# EAGLE design MICRO_MODULAR_batt2 (EAGLE 7.5.0)
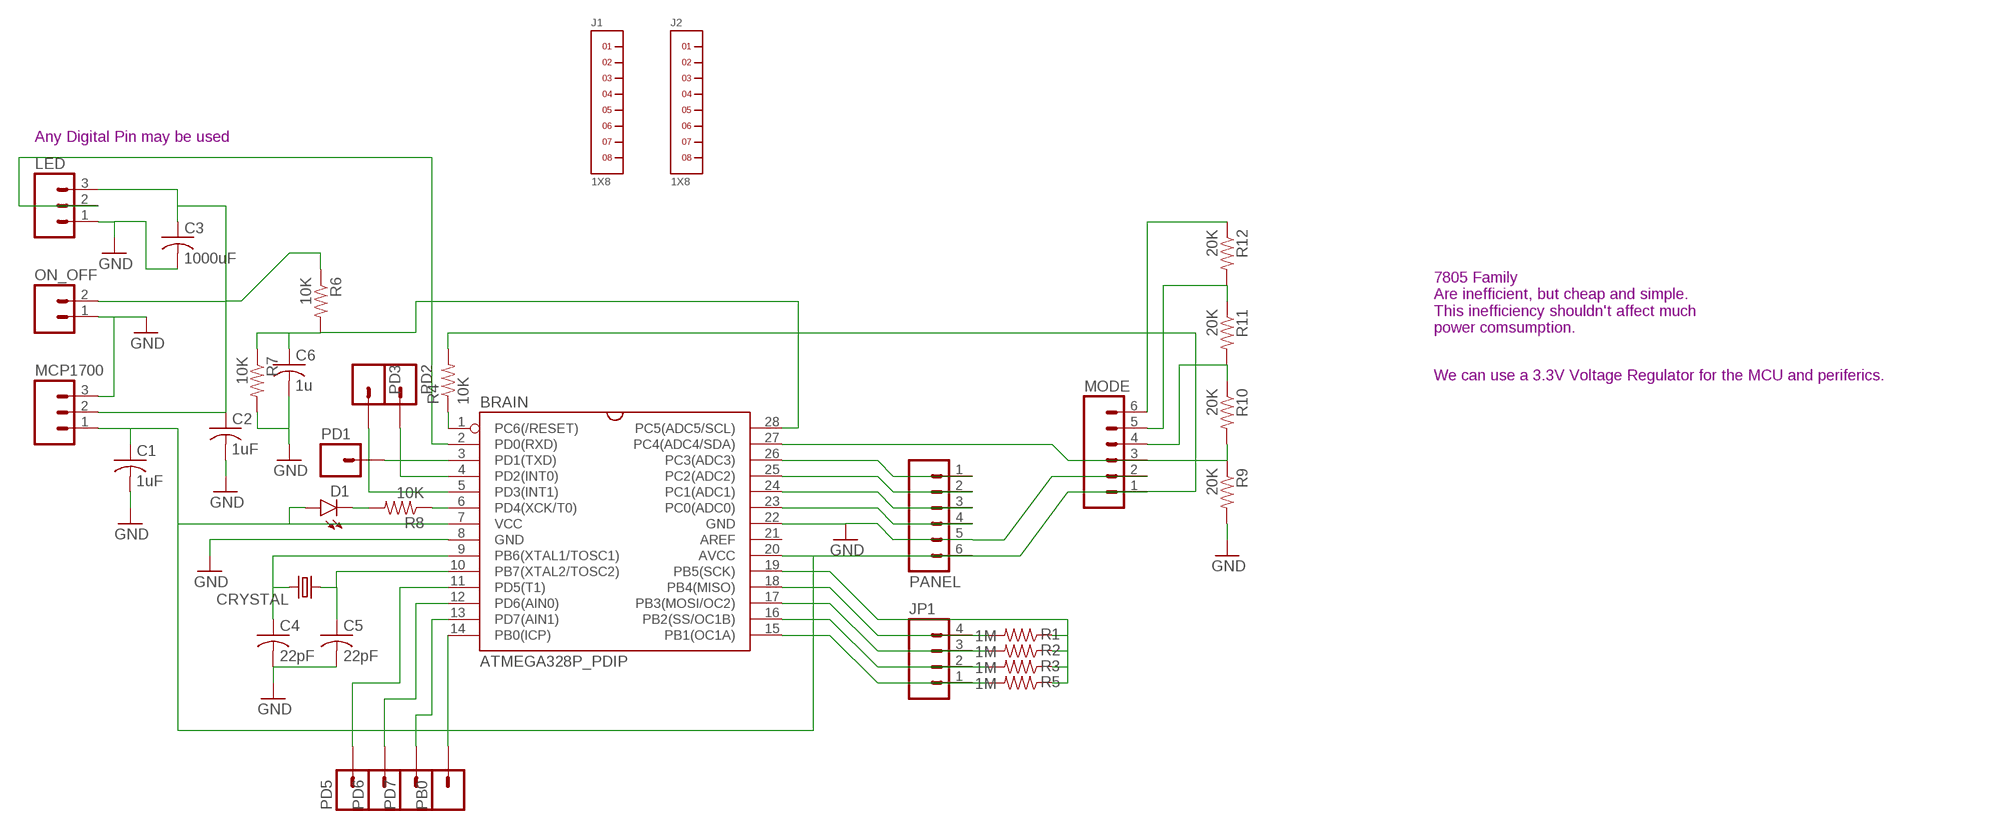
[diagram p0: schematic, sheet 1]

## Parts
BRAIN  ATMEGA328P_PDIP  [DIL-28-3]
C1  1uF  C-US050-025X075  [C050-025X075]
C2  1uF  C-US050-025X075  [C050-025X075]
C3  1000uF  C-US050-075X075  [C050-075X075]
C4  22pF  C-US025-024X044  [C025-024X044]
C5  22pF  C-US025-024X044  [C025-024X044]
C6  1u  C-US050-025X075  [C050-025X075]
CRYSTAL  CRYSTALHC49US  [HC49US]
D1  LED3MM  [LED3MM]
J1  1X8  [1X8]
J2  1X8  [1X8]
JP1  M04PTH  [1X04]
LED  M03PTH  [1X03]
MCP1700  M03PTH  [1X03]
MODE  M06SILK_FEMALE_PTH  [1X06]
ON_OFF  M02PTH  [1X02]
PANEL  M06NO_SILK_FEMALE_PTH  [1X06_NO_SILK]
PB0  M01PTH  [1X01]
PD1  M01PTH  [1X01]
PD2  M01PTH  [1X01]
PD3  M01PTH  [1X01]
PD5  M01PTH  [1X01]
PD6  M01PTH  [1X01]
PD7  M01PTH  [1X01]
R1  1M  RESISTORAXIAL-0.3  [AXIAL-0.3]
R2  1M  RESISTORAXIAL-0.3  [AXIAL-0.3]
R3  1M  RESISTORAXIAL-0.3  [AXIAL-0.3]
R4  10K  RESISTORAXIAL-0.3  [AXIAL-0.3]
R5  1M  RESISTORAXIAL-0.3  [AXIAL-0.3]
R6  10K  RESISTORAXIAL-0.3  [AXIAL-0.3]
R7  10K  RESISTORAXIAL-0.3  [AXIAL-0.3]
R8  10K  RESISTORAXIAL-0.3  [AXIAL-0.3]
R9  20K  RESISTORAXIAL-0.3  [AXIAL-0.3]
R10  20K  RESISTORAXIAL-0.3  [AXIAL-0.3]
R11  20K  RESISTORAXIAL-0.3  [AXIAL-0.3]
R12  20K  RESISTORAXIAL-0.3  [AXIAL-0.3]

## Nets
BLUE_BRAIN: BRAIN.25(PC2(ADC2)) PANEL.2
GND: BRAIN.8(GND) BRAIN.22(GND) C1.2 C2.2 C3.2 C4.2 C5.2 C6.2 LED.1 MCP1700.3 MODE.2 ON_OFF.1 PANEL.5 R7.P$2 R9.P$2
GREEN_BRAIN: BRAIN.24(PC1(ADC1)) PANEL.3
LEDS_BRAIN: BRAIN.2(PD0(RXD)) LED.2
N$1: BRAIN.28(PC5(ADC5/SCL)) C6.1 R6.P$2 R7.P$1
N$2: BRAIN.15(PB1(OC1A)) JP1.1 R5.P$2
N$3: BRAIN.16(PB2(SS/OC1B)) JP1.2 R3.P$2
N$4: BRAIN.17(PB3(MOSI/OC2)) JP1.3 R2.P$2
N$5: BRAIN.18(PB4(MISO)) JP1.4 R1.P$2
N$6: BRAIN.19(PB5(SCK)) R1.P$1 R2.P$1 R3.P$1 R5.P$1
N$7: BRAIN.9(PB6(XTAL1/TOSC1)) C4.1 CRYSTAL.2
N$8: BRAIN.10(PB7(XTAL2/TOSC2)) C5.1 CRYSTAL.1
N$9: BRAIN.5(PD3(INT1)) PD3.1
N$10: D1.K(C) R8.P$2
N$11: BRAIN.6(PD4(XCK/T0)) R8.P$1
N$12: BRAIN.4(PD2(INT0)) PD2.1
N$13: BRAIN.27(PC4(ADC4/SDA)) MODE.3 R9.P$1 R10.P$2
N$14: BRAIN.12(PD6(AIN0)) PD6.1
N$15: BRAIN.13(PD7(AIN1)) PD7.1
N$16: BRAIN.14(PB0(ICP)) PB0.1
N$17: BRAIN.3(PD1(TXD)) PD1.1
N$18: BRAIN.11(PD5(T1)) PD5.1
N$19: MODE.6 R12.P$1
N$20: MODE.5 R11.P$1 R12.P$2
N$21: MODE.4 R10.P$1 R11.P$2
RED_BRAIN: BRAIN.26(PC3(ADC3)) PANEL.1
RST: BRAIN.1(PC6(/RESET)) R4.P$1
SPEED_BRAIN: BRAIN.23(PC0(ADC0)) PANEL.4
SWITCH_BRAIN: C2.1 C3.1 LED.3 MCP1700.2 ON_OFF.2 R6.P$1
V_5V: BRAIN.7(VCC) BRAIN.20(AVCC) C1.1 D1.A MCP1700.1 MODE.1 PANEL.6 R4.P$2
Unconnected: BRAIN.21(AREF) J1.1 J1.2 J1.3 J1.4 J1.5 J1.6 J1.7 J1.8 J2.1 J2.2 J2.3 J2.4 J2.5 J2.6 J2.7 J2.8

## Notes on the sheet
- Any Digital Pin may be used
- 7805 Family
  Are inefficient, but cheap and simple.
  This inefficiency shouldn't affect much
  power comsumption.
- We can use a 3.3V Voltage Regulator for the MCU and periferics.

## Library data of the parts
BRAIN = RodrigoMarques_Parts:ATMEGA328P_PDIP: uC used in the Arduino 32kb flash, 1k EEPROM, 2k SRAM This is the through-hole version of this chip.
C1-C6 = adafruit:C-US: CAPACITOR, American symbol
CRYSTAL = SparkFun-FreqCtrl:CRYSTAL: Various standard crystals. Proven footprints.
D1 = SparkFun-LED:LED: LEDs Standard schematic elements and footprints for 5mm, 3mm, 1206, and 0603 sized LEDs. 5mm - Spark Fun Electronics SKU : COM-00529 (and others)
J1 J2 = RodrigoMarques_Parts:1X8: 1x8 Header Specificications 2mm pitch. 1 row 8 pins
JP1 = SparkFun-Connectors:M04: Header 4 Standard 4-pin 0.1" header. Use with straight break away headers (SKU : PRT-00116), right angle break away headers (PRT-00553), swiss pins (PRT-00743), machine pins (PRT-00117), and female headers (PRT-00115). Molex polarized connector foot print use with SKU : PRT-08231 with associated crimp pins and housings. 1MM SMD Version SKU: PRT-10208
LED MCP1700 = SparkFun-Connectors:M03: Header 3 Standard 3-pin 0.1" header. Use with straight break away headers (SKU : PRT-00116), right angle break away headers (PRT-00553), swiss pins (PRT-00743), machine pins (PRT-00117), and female headers (PRT-00115). Molex polarized connector foot print use with SKU : PRT-08232 with associated crimp pins and housings.
MODE PANEL = SparkFun-Connectors:M06: Header 6 Standard 6-pin 0.1" header. Use with straight break away headers (SKU : PRT-00116), right angle break away headers (PRT-00553), swiss pins (PRT-00743), machine pins (PRT-00117), and female headers (PRT-00115). Molex polarized connector foot print use with SKU : PRT-08094 with associated crimp pins and housings. NOTES ON THE VARIANTS LOCK and LOCK_LONGPADS... This footprint was designed to help hold the alignment of a through-hole component (i.e. 6-pin header) while soldering it into place. You may notice that each hole has been shifted either up or down by 0.005 of an inch from it's more standard position (which is a perfectly straight line). This slight alteration caused the pins (the squares in the middle) to touch the edges of the holes. Because they are alternating, it causes a "brace" to hold the component in place. 0.005 has proven to be the perfect amount of "off-center" position when using our standard breakaway headers. Although looks a little odd when you look at the bare footprint, once you have a header in there, the alteration is very hard to notice. Also,if you push a header all the way into place, it is covered up entirely on the bottom side. This idea of altering the position of holes to aid alignment will be further integrated into the Sparkfun Library for other footprints. It can help hold any component with 3 or more connection pins.; PROD_ID: CONN-08437
ON_OFF = SparkFun-Connectors:M02: Standard 2-pin 0.1" header. Use with - straight break away headers ( PRT-00116) - right angle break away headers (PRT-00553) - swiss pins (PRT-00743) - machine pins (PRT-00117) - female headers (PRT-00115) Molex polarized connector foot print use with: PRT-08233 with associated crimp pins and housings. 2.54_SCREWTERM for use with PRT-10571. 3.5mm Screw Terminal footprints for PRT-08084 5mm Screw Terminal footprints for use with PRT-08432
PB0 PD1-PD3 PD5-PD7 = SparkFun-Connectors:M01: Header 1 Standard 1-pin 0.1" header. Use with straight break away headers (SKU : PRT-00116), right angle break away headers (PRT-00553), swiss pins (PRT-00743), machine pins (PRT-00117), and female headers (PRT-00115). SMTSO-256-ET is a "flush mount" nut for a 4-40 screw. The older package used to be too tight, and did not allow it to sit properly thru the drill hit. The latest (0.165DIA) fits nice and snug.
R1-R12 = SparkFun-Passives:RESISTOR: Resistor Basic schematic elements and footprints for 0603, 1206, and PTH resistors.

## Net classes
0 default: width 0.254 mm

## Board
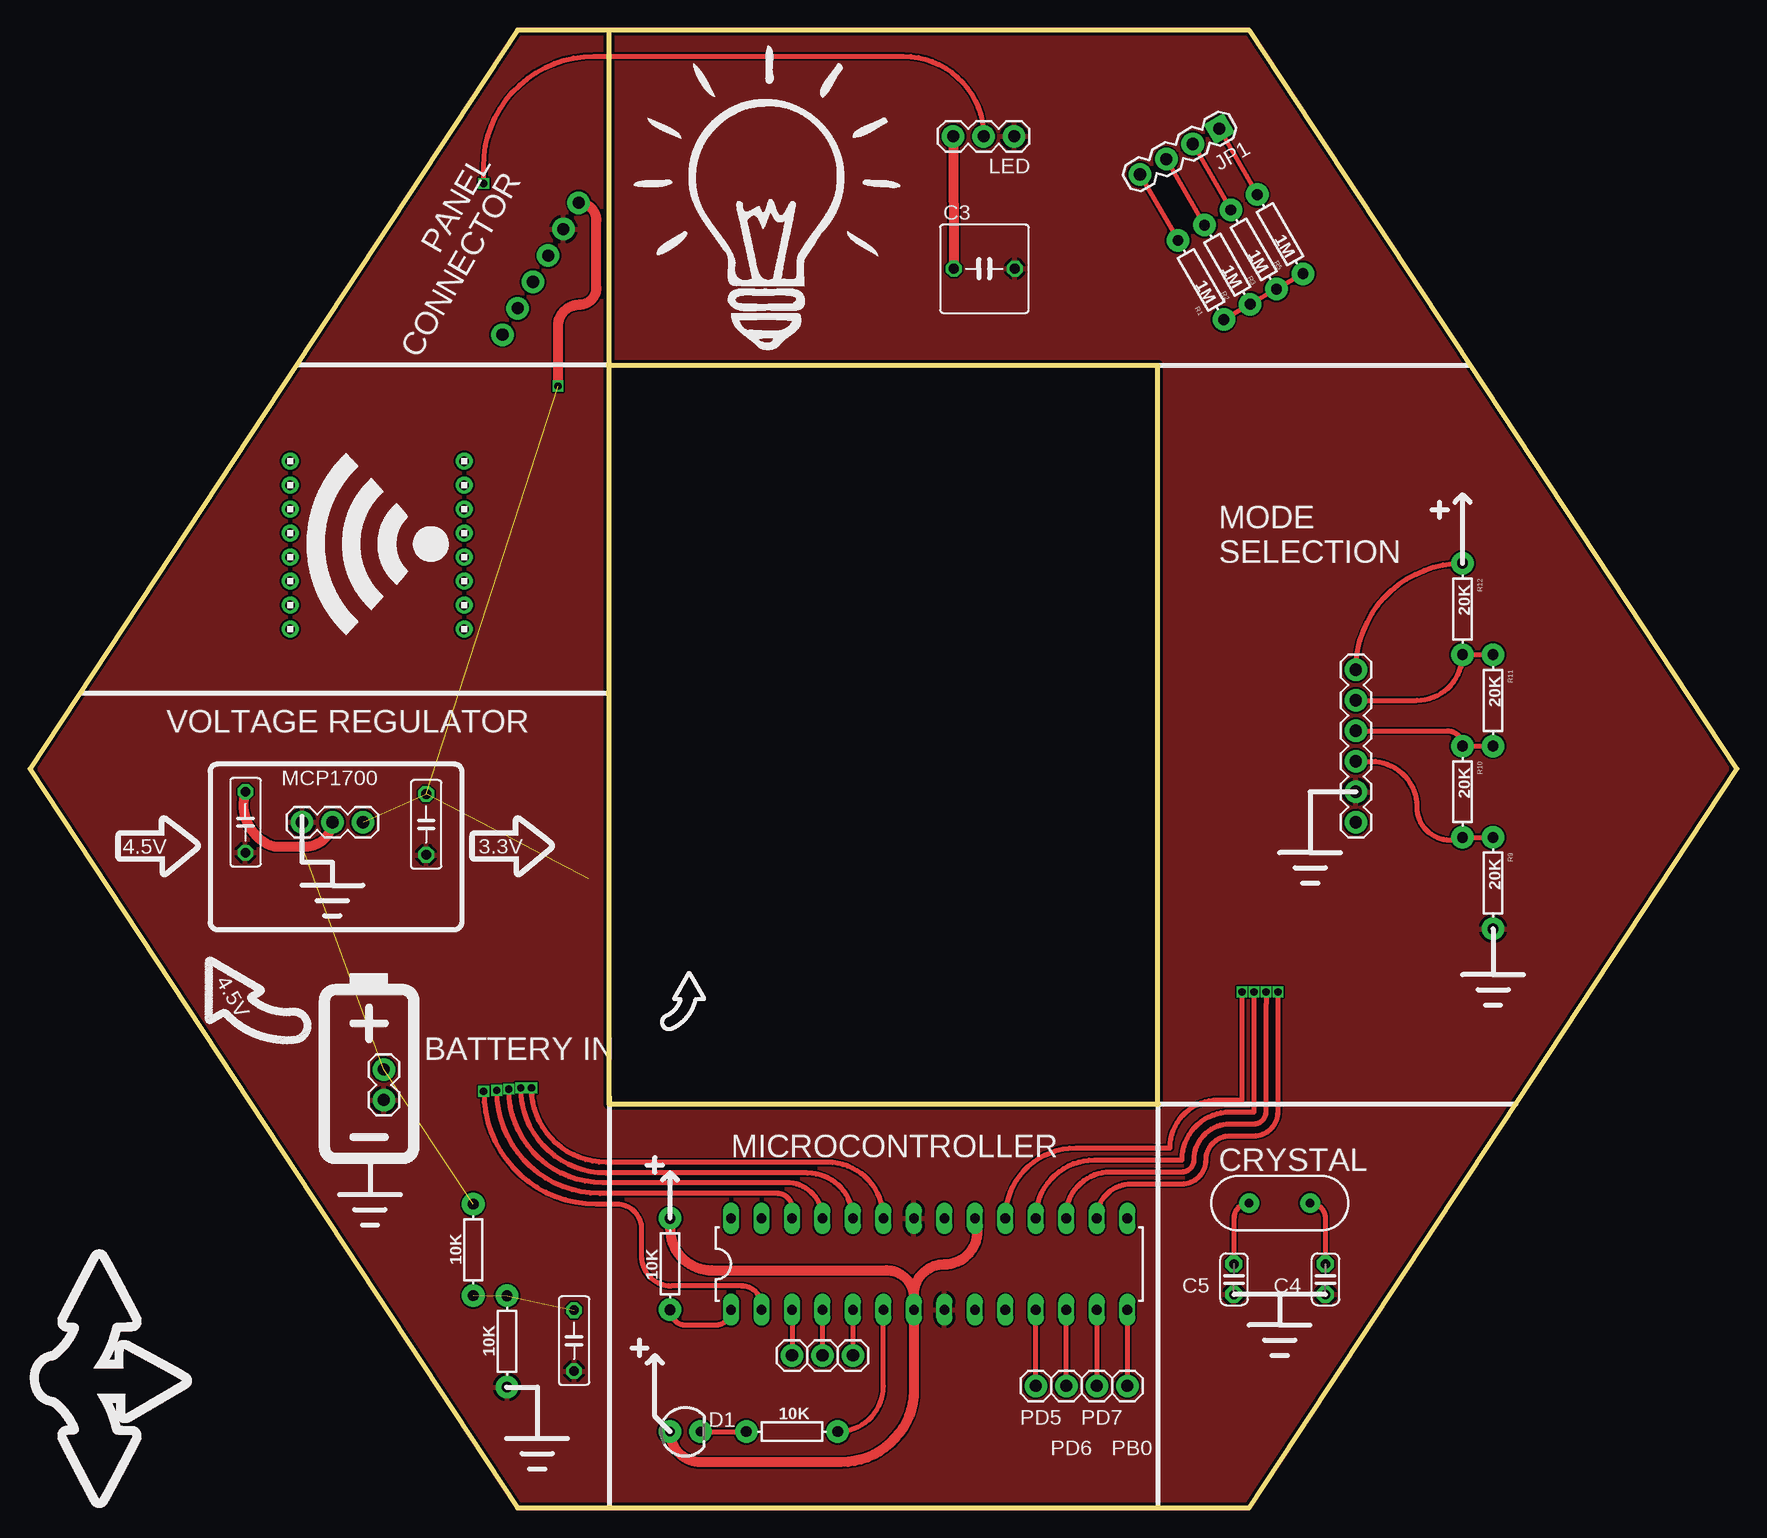
[diagram p1: board, top side]
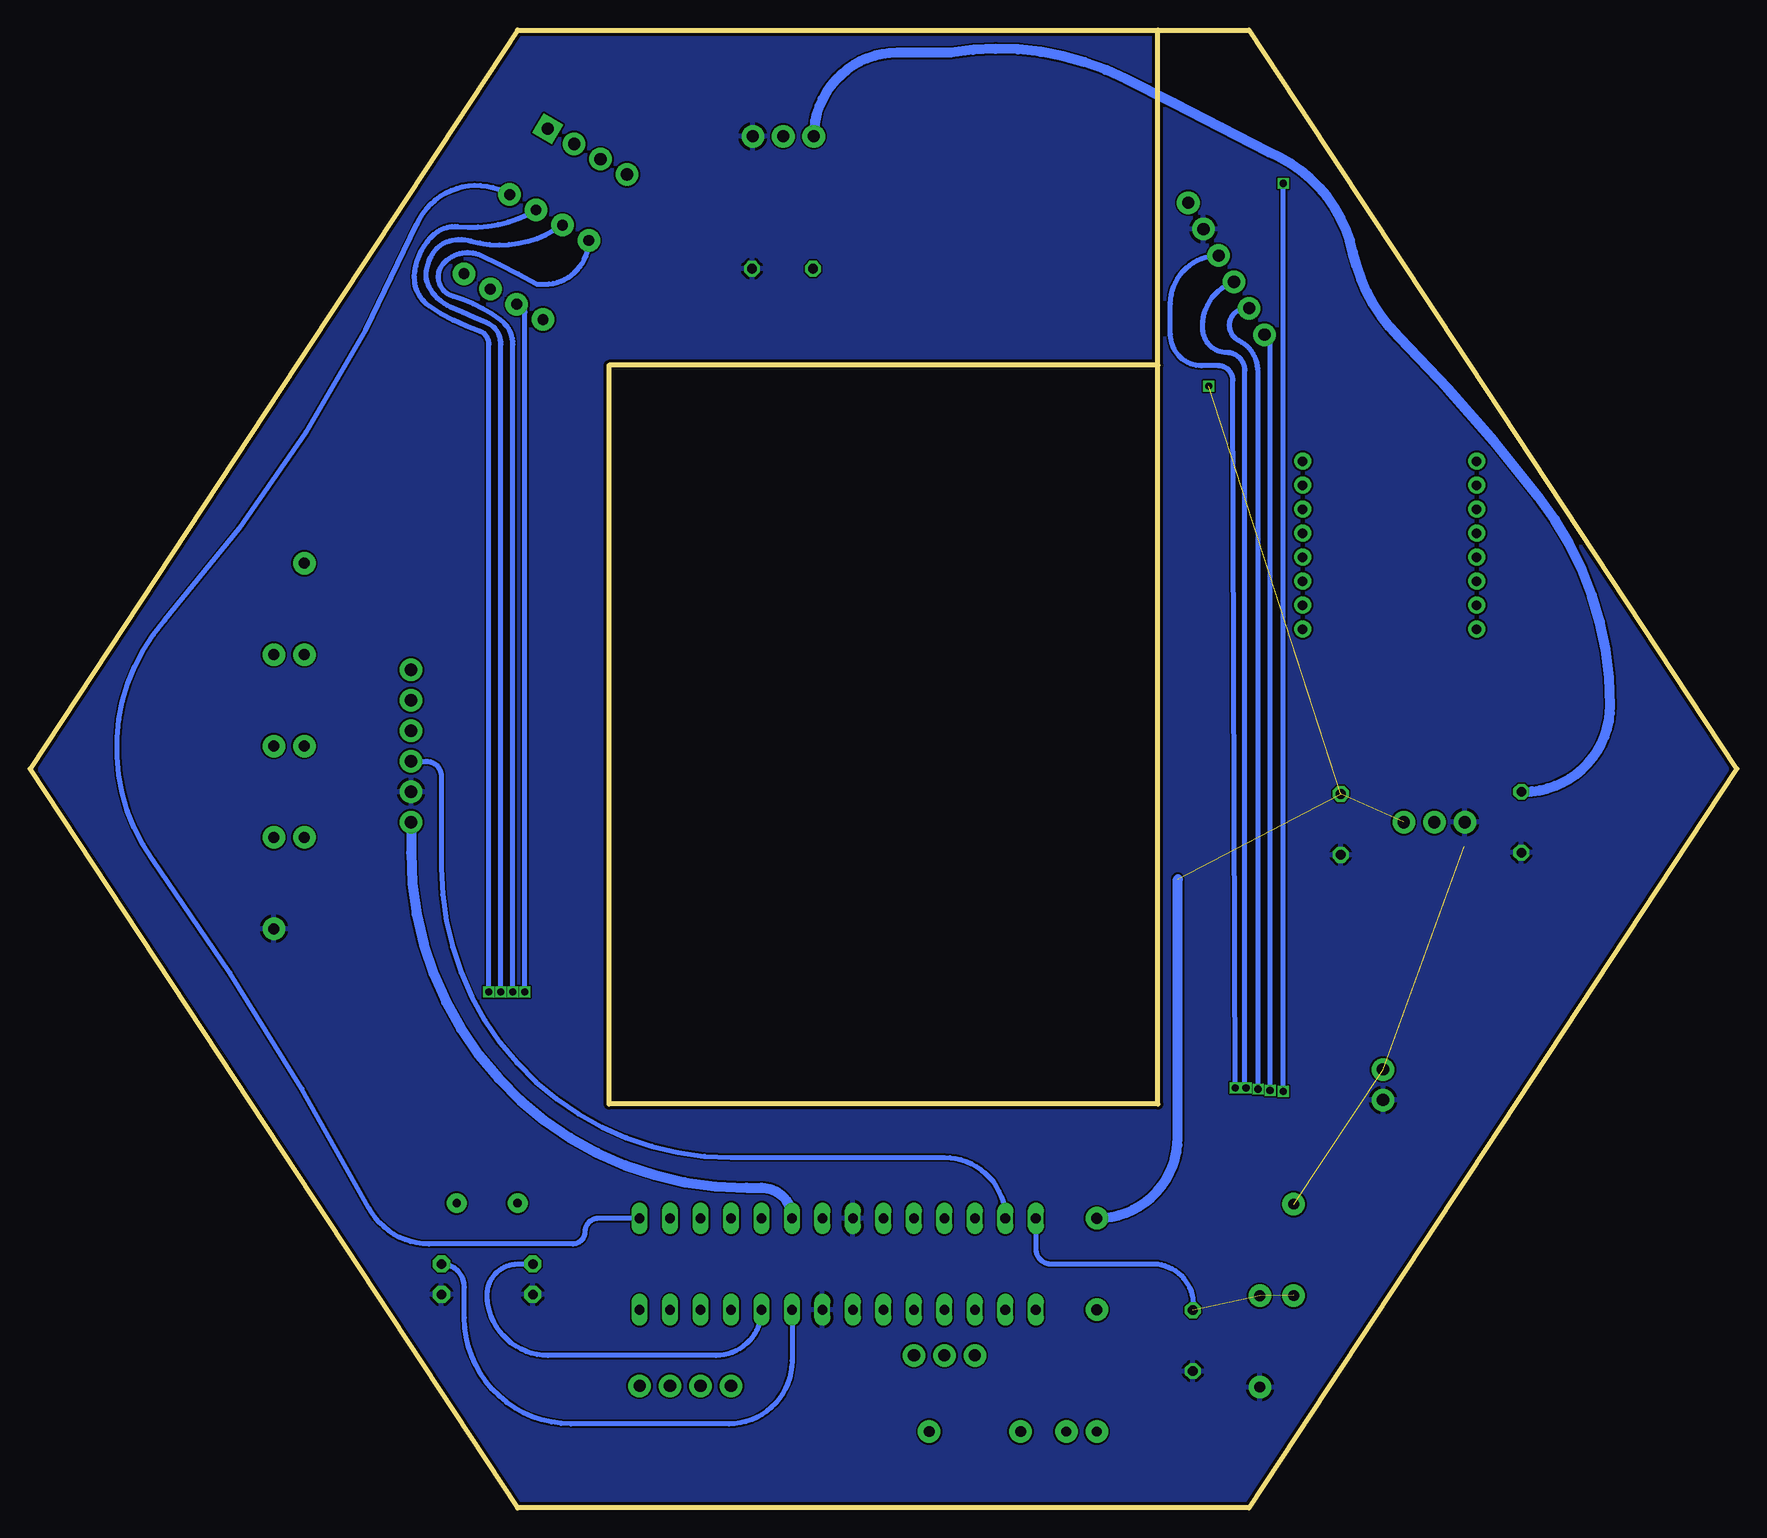
[diagram p2: board, bottom side, seen from below]

Size 142.24 x 123.19 mm. Coordinates in mm from the lower left corner, seen from the top.
Outline: 48.26,123.19 101.6,123.19 142.24,61.59 101.6,0 40.64,0 0,61.59 40.64,123.19 48.26,123.19
Outline: 48.26,95.25 48.26,33.66 93.98,33.66 93.98,95.25 48.26,95.25
Outline: 48.26,95.25 48.26,123.19
Copper layers (1*16): Top 0.035mm / dielectric 1.5mm / Bottom 0.035mm
Design rules "seeedstudio_2l": minimum track width 6mil, minimum drill 12mil, track to track 6mil, track to pad 6mil, pad to pad 6mil, via to via 6mil, smd to smd 0mil, copper to edge 10mil, drill to drill 10mil, minimum pad ring 10mil, minimum via ring 6mil, stop-mask expansion 2mil, vias tented up to drill 100mil, thermal gap 10mil

### Footprints (pad centres in the part's own frame; a part is rotated, then mirrored left to right if it is on the bottom)
DIL-28-3 = drill 0.813 long: 1 -16.51,-3.81; 2 -13.97,-3.81; 3 -11.43,-3.81; 4 -8.89,-3.81; 5 -6.35,-3.81; 6 -3.81,-3.81; 7 -1.27,-3.81; 8 1.27,-3.81; 9 3.81,-3.81; 10 6.35,-3.81; 11 8.89,-3.81; 12 11.43,-3.81; 13 13.97,-3.81; 14 16.51,-3.81; 15 16.51,3.81; 16 13.97,3.81; 17 11.43,3.81; 18 8.89,3.81; 19 6.35,3.81; 20 3.81,3.81; 21 1.27,3.81; 22 -1.27,3.81; 23 -3.81,3.81; 24 -6.35,3.81; 25 -8.89,3.81; 26 -11.43,3.81; 27 -13.97,3.81; 28 -16.51,3.81
C050-025X075 = drill 0.813 octagon: 1 -2.54,0; 2 2.54,0
C050-075X075 = drill 0.813 octagon: 1 -2.54,0; 2 2.54,0
C025-024X044 = drill 0.813 pad 1.422 octagon: 1 -1.27,0; 2 1.27,0
HC49US = drill 0.7 pad 1.651: 1 -2.54,0; 2 2.54,0
LED3MM = drill 0.813 pad 1.88: A -1.27,0; K 1.27,0
1X8 = drill 0.8 pad 1.422: 1 -7,0; 2 -5,0; 3 -3,0; 4 -1,0; 5 1,0; 6 3,0; 7 5,0; 8 7,0
1X04 = drill 1.016 pad 1.88 square: 1 0,0 | drill 1.016 pad 1.88: 2 2.54,0; 3 5.08,0; 4 7.62,0
1X03 = drill 1.016 pad 1.88: 1 0,0; 2 2.54,0; 3 5.08,0
1X06 = drill 1.016 pad 1.88: 1 0,0; 2 2.54,0; 3 5.08,0; 4 7.62,0; 5 10.16,0; 6 12.7,0
1X02 = drill 1.016 pad 1.88: 1 0,0; 2 2.54,0
1X06_NO_SILK = drill 1.016 pad 1.88: 1 0,0; 2 2.54,0; 3 5.08,0; 4 7.62,0; 5 10.16,0; 6 12.7,0
1X01 = drill 1.016 pad 1.88: 1 0,0
AXIAL-0.3 = drill 0.9 pad 1.88: P$1 -3.81,0; P$2 3.81,0

### Placement (x,y rotation side)
BRAIN  74.93,20.32 0 top
C1  33.01,56.97 270 top
C2  17.96,57.15 270 top
C3  79.53,103.29 0 top
C4  107.95,19.05 270 top
C5  100.33,19.05 270 top
C6  45.34,13.93 270 top
CRYSTAL  104.14,25.4 0 top
D1  54.61,6.35 0 top
J1  21.68,80.24 90 top
J2  36.18,80.24 90 top
JP1  99.1,114.96 210 top
LED  82.01,114.33 180 top
MCP1700  27.75,57.15 180 top
MODE  110.49,57.15 90 top
ON_OFF  29.49,34 90 top
PANEL  39.37,97.79 60 top
PB0  91.44,10.16 0 top
PD1  63.5,12.7 0 top
PD2  66.04,12.7 0 top
PD3  68.58,12.7 0 top
PD5  83.82,10.16 0 top
PD6  86.36,10.16 0 top
PD7  88.9,10.16 0 top
R1  97.58,102.36 120 top
R2  99.78,103.63 120 top
R3  101.98,104.9 120 top
R4  53.34,20.32 90 top
R5  104.18,106.17 120 top
R6  36.94,21.5 270 top
R7  39.75,13.87 270 top
R8  63.5,6.35 180 top
R9  121.92,52.07 270 top
R10  119.38,59.69 270 top
R11  121.92,67.31 270 top
R12  119.38,74.93 270 top

### Tracks (layer width: path | path; a pad name or v marks a point on that pad's centre or on a via)
BLUE_BRAIN  (via drill 0.6)
  Top 0.406: BRAIN.25 arc90 63.07,27.1 47.7,27.1 arc-90 v39.9,34.9
  Bottom 0.406: v39.9,34.9 39.9,94.7 arc-63 41.5,97.3 arc162 PANEL.2
GND
  pour Top: -12.7,130.81 -12.7,-3.81 181.61,-3.81 181.61,130.81
  pour Bottom: -6.35,132.08 -6.35,-7.62 160.02,-7.62 160.02,132.08
GREEN_BRAIN  (via drill 0.6)
  Top 0.406: BRAIN.24 arc90 64.81,27.9 48,27.9 arc-90 v40.9,35
  Bottom 0.406: v40.9,35 41,35 41,94.8 arc-90 42.5,96.3 arc84 44.5,98.1 arc77 PANEL.3
LEDS_BRAIN  (via drill 0.6)
  Top 0.406: BRAIN.2 60.96,16.84 arc90 59.3,18.5 53.43,18.5 arc-90 50.95,20.98 50.95,23.27 arc90 48.9,25.32 47.18,25.32 arc-90 v37.8,34.7 | v37.8,110.4 37.8,111.8 arc-90 47,121 72.8,121 arc-90 LED.2
  Bottom 0.406: v37.8,34.7 v37.8,110.4
N$1  (2 unrouted)
  Bottom 0.406: BRAIN.28 58.42,21.59 arc-90 57.15,20.32 48.26,20.32 arc90 C6.1
N$2
  Top 0.406: JP1.1 R5.P$2
  Bottom 0.406: BRAIN.15 94.87,24.13 arc-90 96,23 arc90 97,22 109,22 arc62 114,25 arc-8 132,54 arc77 131,74 arc-18 110,107 arc97 R5.P$2
N$3  (via drill 0.6)
  Top 0.406: JP1.2 R3.P$2 | BRAIN.16 arc-90 91.77,27 96,27 arc90 98,29 arc-90 100,31 102,31 arc90 104,33 v104,43
  Bottom 0.406: v104,43 104,97 arc-72 104.8,98.1 arc17 109,100.2 arc56 110.2,102.6 arc47 108.5,106.2 arc47 106.6,106.8 arc-36 R3.P$2
N$4  (via drill 0.6)
  Top 0.406: JP1.3 R2.P$2 | BRAIN.17 86.36,24.36 arc-90 90,28 96,28 arc90 97,29 arc-90 100,32 102,32 arc90 103,33 103,42 v103,43
  Bottom 0.406: v103,43 103,97 arc-67 104.2,98.8 arc2 107.2,100.1 arc38 109,101.8 arc38 109.2,103.1 arc19 108.7,104.5 arc45 107.3,105.6 arc31 105.5,105.6 arc-51 R2.P$2
N$5  (via drill 0.6)
  Top 0.406: JP1.4 R1.P$2 | BRAIN.18 arc-90 88.69,29 96,29 arc-90 100,33 102,33 v102,43
  Bottom 0.406: v102,43 102,97 arc-53 103,99 arc-21 107,101 arc114 107.8,103.7 arc40 106.2,104.6 arc34 104.7,104.4 arc5 100,102 99.33,102 arc-90 R1.P$2
N$6  (via drill 0.6)
  Top 0.406: R5.P$1 R3.P$1 R2.P$1 R1.P$1 | BRAIN.19 arc-90 87.15,30 95,30 arc-90 99,34 101,34 v101,43
  Bottom 0.406: v101,43 101,99.64 arc-90 R2.P$1
N$7
  Top 0.406: CRYSTAL.2 arc-90 107.95,24.13 C4.1
  Bottom 0.406: C4.1 arc90 106.05,18.41 106.05,15.88 arc-90 97.17,7 84,7 arc-90 78.74,12.26 BRAIN.9
N$8
  Top 0.406: CRYSTAL.1 arc90 100.33,24.13 C5.1
  Bottom 0.406: BRAIN.10 arc90 85.09,12.7 99.06,12.7 arc90 104.14,17.78 arc90 101.6,20.32 C5.1
N$9
  Top 0.406: BRAIN.5 PD3.1
N$10
  Top 0.406: D1.K R8.P$2
N$11
  Top 0.406: R8.P$1 arc90 71.12,10.16 BRAIN.6
N$12
  Top 0.406: BRAIN.4 PD2.1
N$13
  Top 0.406: R9.P$1 R10.P$2 arc-113 115.57,58.42 arc90 111.76,62.23 MODE.3
  Bottom 0.406: MODE.3 109.22,62.23 arc90 107.95,60.96 107.95,53.34 arc-90 83.82,29.21 66.04,29.21 arc90 BRAIN.27
N$14
  Top 0.406: PD6.1 BRAIN.12
N$15
  Top 0.406: BRAIN.13 PD7.1
N$16
  Top 0.406: BRAIN.14 PB0.1
N$17
  Top 0.406: BRAIN.3 PD1.1
N$18
  Top 0.406: PD5.1 BRAIN.11
N$19
  Top 0.406: MODE.6 arc-90 R12.P$1
N$20
  Top 0.406: R11.P$1 R12.P$2 arc-90 115.57,67.31 MODE.5
N$21
  Top 0.406: R11.P$2 R10.P$1 arc90 118.11,64.77 MODE.4
RED_BRAIN  (via drill 0.6)
  Top 0.406: BRAIN.26 63.5,25 arc90 62.3,26.2 47.5,26.2 arc-90 v38.9,34.8
  Bottom 0.406: v38.9,34.8 38.9,97.32 arc-90 PANEL.1
RST
  Top 0.406: R4.P$1 arc90 54.61,15.24 57.15,15.24 arc90 BRAIN.1
SPEED_BRAIN  (via drill 0.6)
  Top 0.406: BRAIN.23 arc90 66.45,28.8 48,28.8 arc-90 v41.8,35
  Bottom 0.406: v41.8,35 42,94 arc-90 43.2,95.2 44.6,95.2 arc90 47.2,97.8 47.2,100.37 arc90 PANEL.4
SWITCH_BRAIN  (2 unrouted)
  Top 0.813: C2.1 arc90 20.3,55.13 22.71,55.13 arc90 MCP1700.2 | LED.3 arc0 C3.1
  Bottom 0.813: LED.3 arc90 69.96,121.3 65.5,121.3 arc36 50.9,119.1 arc1 39,113 arc55 31.99,104.64 arc-32 28.16,97.56 arc7 16.54,84.29 arc38 10.55,66.88 arc90 17.74,59.69 C2.1
V_5V  (via drill 0.6)  (3 unrouted)
  Top 0.406: 73.66,17.5 73.66,17.76
  Top 0.813: 73.66,17.76 arc-90 76.2,20.3 arc113 BRAIN.20 | D1.A arc90 55.89,3.8 67.6,3.8 arc90 73.66,9.86 BRAIN.7 73.66,17.5 arc90 71.36,19.8 56.8,19.8 arc-90 53.34,23.26 R4.P$2 | v44,93.5 44,98.5 arc-90 45.8,100.3 arc90 47.2,101.7 47.2,107.31 arc90 PANEL.6
  Bottom 0.813: MODE.1 110.49,54.61 arc-90 82.55,26.67 81.28,26.67 arc90 BRAIN.20 | R4.P$2 arc-90 46.6,30.87 46.58,52.4 | v44.01,93.49 arc90 v44,93.5

### Text on the board
tPlace: PANEL / CONNECTOR | MODE / SELECTION | VOLTAGE REGULATOR | 4.5V | 3.3V | 4.5V | BATTERY IN | MICROCONTROLLER | C:/Users/Rodrigo/Desktop/multipleArrow.bmp